# Altium project PAY_IFB.PrjPcb (part 6 of 7)

## Sheet CAN_PHY.SchDoc
size A3; SheetNumber: 19; SheetTotal: 23
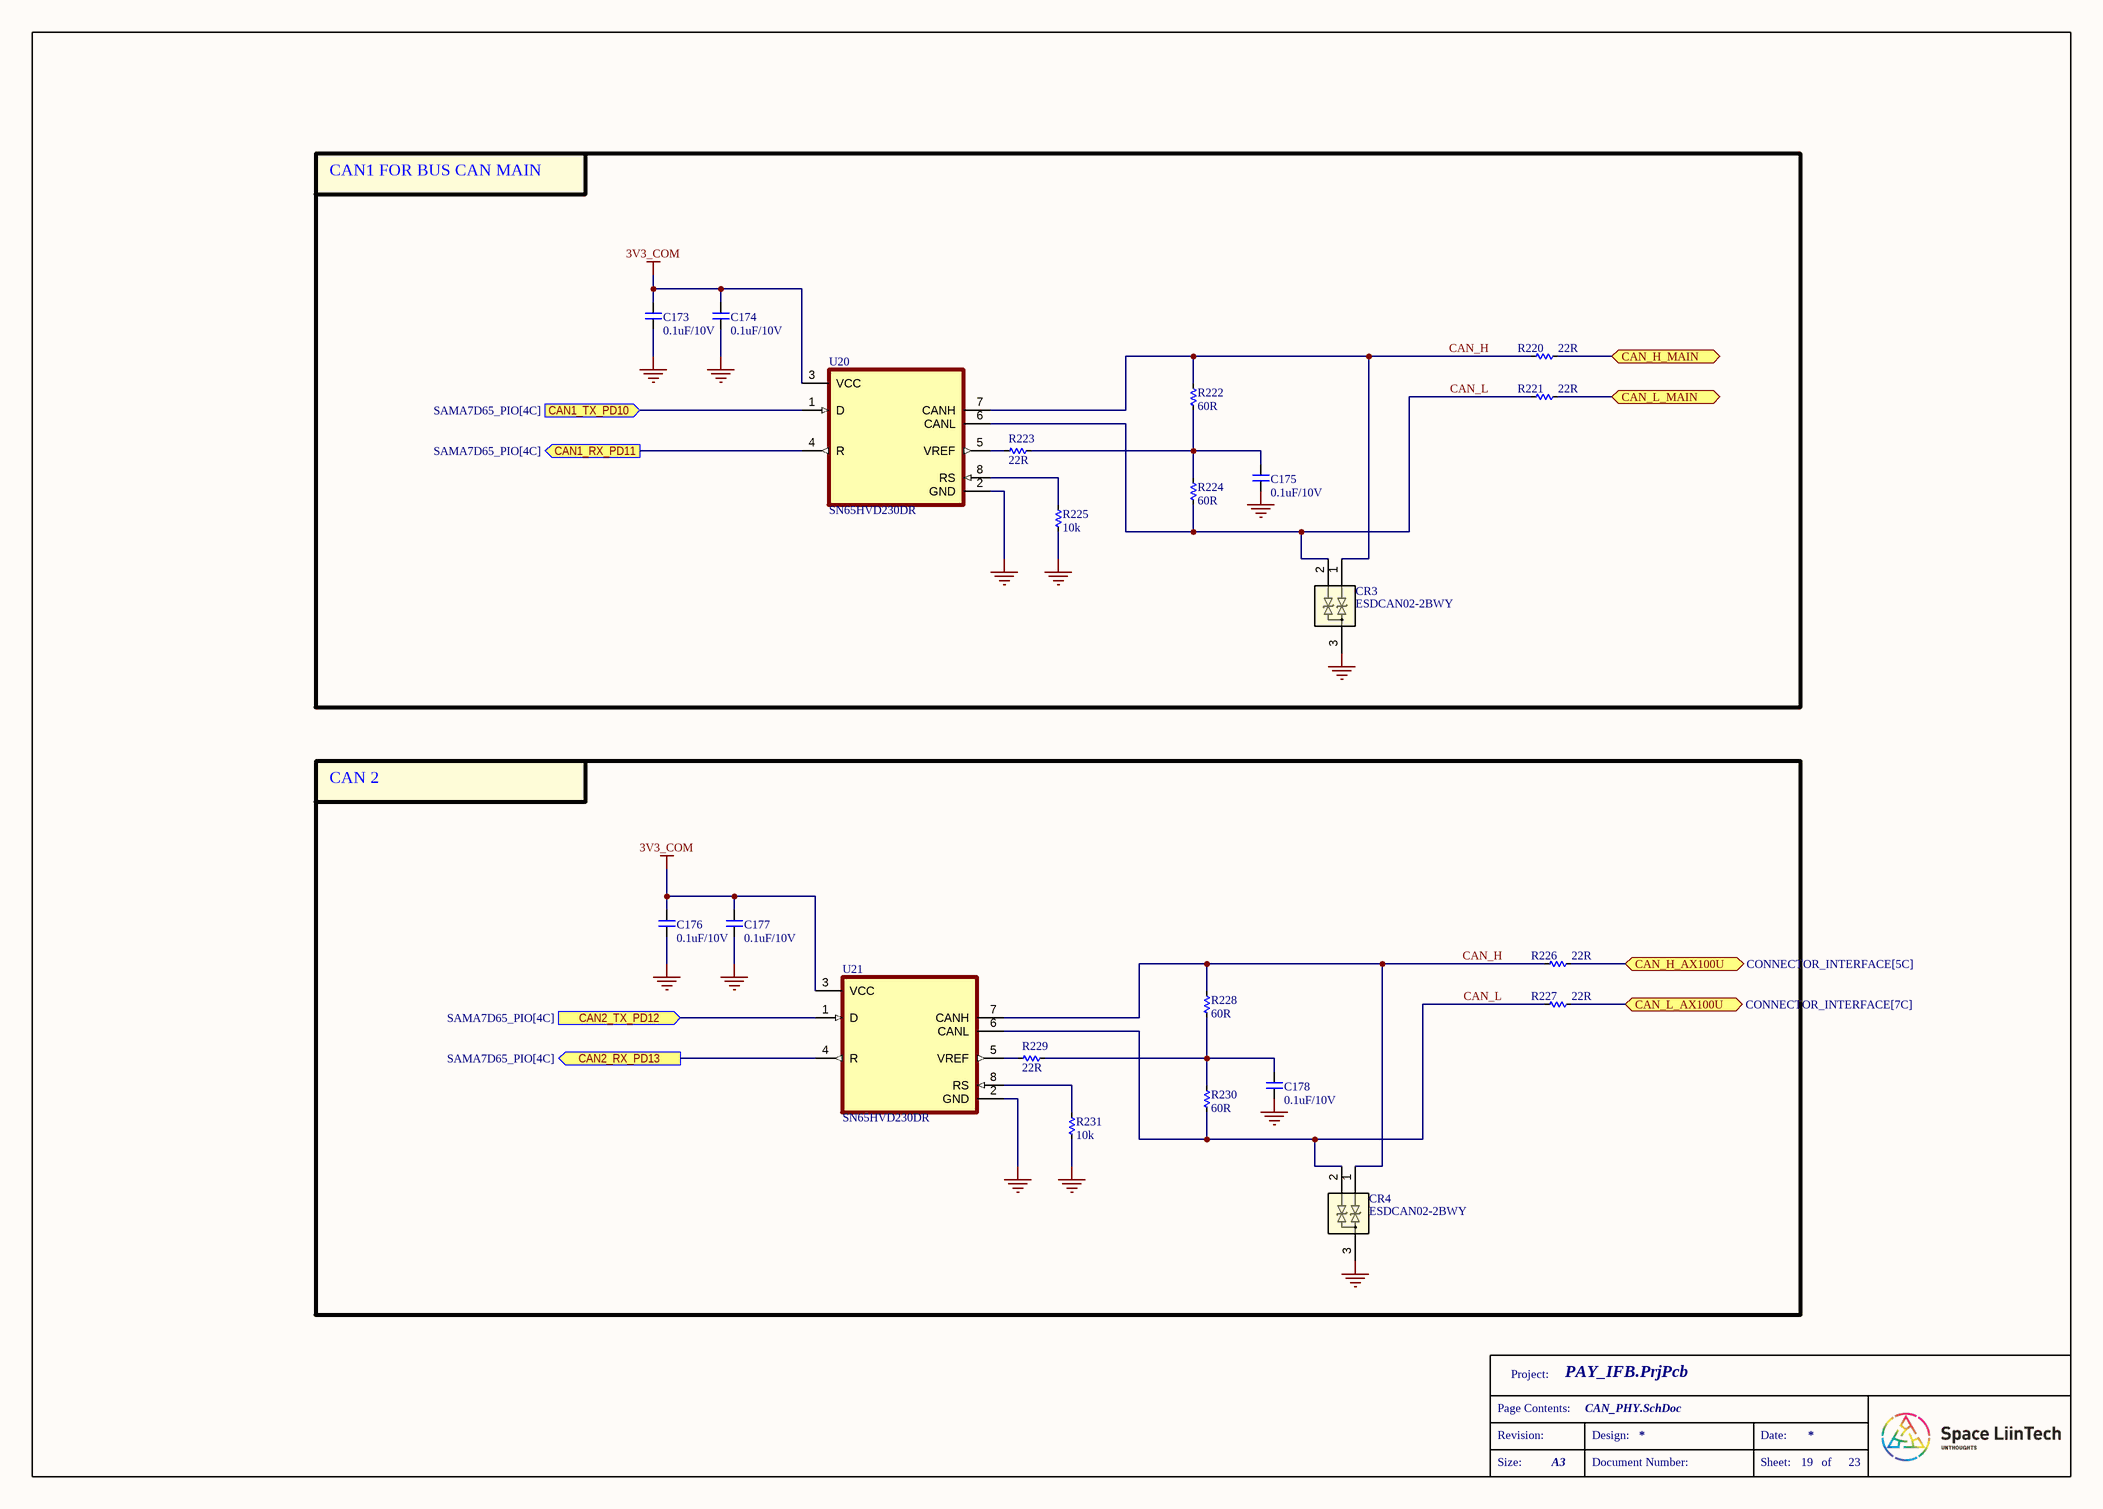
[diagram p23: CAN_PHY.SchDoc]

### Parts
(Parts that share a designator on the sheet are numbered #1, #2 ... from top to bottom, then left to right.)
C173  0.1uF/10V  [CAP_C_1005X50_L]
C174  0.1uF/10V  [CAP_C_1005X50_L]
C175  0.1uF/10V  [CAP_C_1005X50_L]
C176  0.1uF/10V  [CAP_C_1005X50_L]
C177  0.1uF/10V  [CAP_C_1005X50_L]
C178  0.1uF/10V  [CAP_C_1005X50_L]
CR3  ESDCAN02-2BWY  [SOT323-3L_STM]
CR4  ESDCAN02-2BWY  [SOT323-3L_STM]
R220  22R  [RES_C_1005x30_L]
R221  22R  [RES_C_1005x30_L]
R222  60R  [RES_C_1005x30_L]
R223  22R  [RES_C_1005x30_L]
R224  60R  [RES_C_1005x30_L]
R225  10k  [RES_C_1005x30_L]
R226#1  22R  [RES_C_1005x30_L]
R227#1  22R  [RES_C_1005x30_L]
R228#1  60R  [RES_C_1005x30_L]
R229  22R  [RES_C_1005x30_L]
R230  60R  [RES_C_1005x30_L]
R231  10k  [RES_C_1005x30_L]
U20  SN65HVD230DR  [SOIC127P599X175-8N]
U21  SN65HVD230DR  [SOIC127P599X175-8N]

### Blocks framed on the sheet
CAN1 FOR BUS CAN MAIN: C173-C175 CR3 R220-R225 U20
CAN 2: C176-C178 CR4 R226#1 R227#1 R228#1 R229-R231 U21

### Ports
CAN1_RX_PD11 (out, see SAMA7D65_PIO[4C]), CAN1_TX_PD10 (in, see SAMA7D65_PIO[4C]), CAN2_RX_PD13 (out, see SAMA7D65_PIO[4C]), CAN2_TX_PD12 (in, see SAMA7D65_PIO[4C]), CAN_H_AX100U (bidir, see CONNECTOR_INTERFACE[5C]), CAN_H_MAIN (bidir, see CONNECTOR_EXP[4B], CONNECTOR_INTERFACE[4A], CONNECTOR_INTERFACE[5C]), CAN_L_AX100U (bidir, see CONNECTOR_INTERFACE[7C]), CAN_L_MAIN (bidir, see CONNECTOR_EXP[4B], CONNECTOR_INTERFACE[4A], CONNECTOR_INTERFACE[7C])

### Nets
3V3_COM: C173.2 C174.2 C176.2 C177.2 U20.3(VCC) U21.3(VCC)
GND: C173.1 C174.1 C175.1 C176.1 C177.1 C178.1 CR3.3 CR4.3 R225.2 R231.2 U20.2(GND) U21.2(GND)
CAN_H: CR3.1 CR4.1 R220.1 R222.1 R226#1.1 R228#1.1 U20.7(CANH) U21.7(CANH)
CAN_H_main: R220.2 ; port CAN_H_MAIN
CAN_L: CR3.2 CR4.2 R221.1 R224.2 R227#1.1 R230.2 U20.6(CANL) U21.6(CANL)
CAN_L_main: R221.2 ; port CAN_L_MAIN
NetC175_2: C175.2 R222.2 R223.1 R224.1
NetC178_2: C178.2 R228#1.2 R229.1 R230.1
NetJ9_07: R226#1.2 ; port CAN_H_AX100U
NetJ9_08: R227#1.2 ; port CAN_L_AX100U
NetR131_2: U20.1(D) ; port CAN1_TX_PD10
NetR133_2: U20.4(R) ; port CAN1_RX_PD11
NetR135_2: U21.1(D) ; port CAN2_TX_PD12
NetR137_2: U21.4(R) ; port CAN2_RX_PD13
NetR223_2: R223.2 U20.5(VREF)
NetR225_1: R225.1 U20.8(RS)
NetR229_2: R229.2 U21.5(VREF)
NetR231_1: R231.1 U21.8(RS)

### Notes on the sheet
- Project:
- Page Contents:
- Revision:
- Design:
- Date:
- Size:
- A3
- Document Number:
- Sheet:
- of

### Library data of the parts
C173-C178 = _CAP_C_2: CAP CHIP
CR3 CR4 = ESDCAN02-2BWY: TVS DIODE 26.5VWM 44VC SOT3233; Manufacturer_Name: STMicroelectronics; Copyright: Copyright (C) 2025 Ultra Librarian. All rights reserved.; Manufacturer_Part_Number: ESDCAN02-2BWY; RefDes: RefDes; Type: Type
R220-R225 R226#1 R227#1 R228#1 R229-R231 = _RES_B_2: RES
U20 U21 = SN65HVD230DR: 3.3 V CAN Transceiver with Standby Mode; MF: Texas Instruments; SnapEDA_Link: https://www.snapeda.com/parts/SN65HVD230DR/Texas+Instruments/view-part/?ref=snap; Package: SOIC-8 Texas Instruments; Value: *; MP: SN65HVD230DR; Check_prices: https://www.snapeda.com/parts/SN65HVD230DR/Texas+Instruments/view-part/?ref=eda

## Sheet RS485.SchDoc
size 420 x 297 mm; SheetNumber: 20; SheetTotal: 23
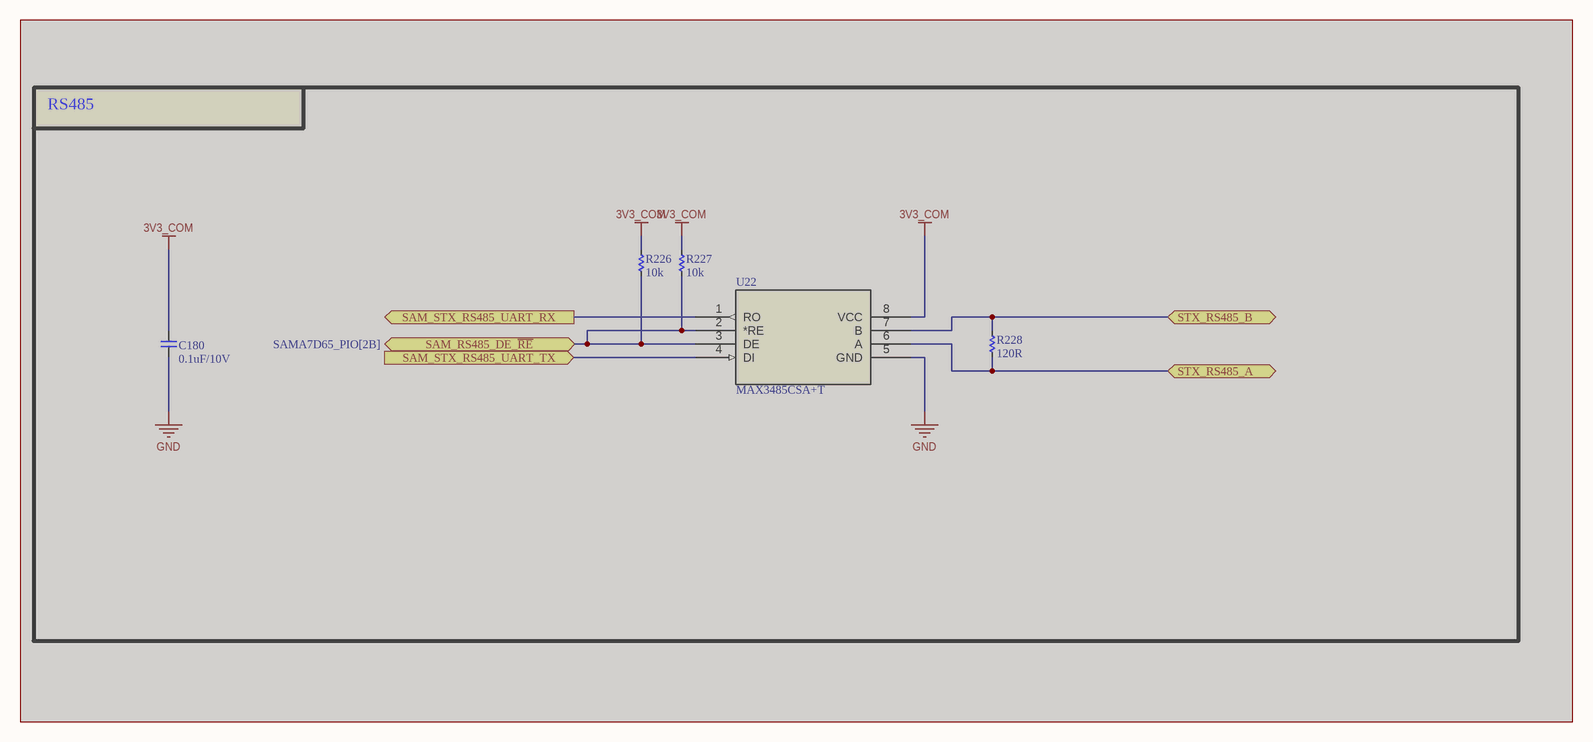
[diagram p24: RS485.SchDoc]

### Parts
(Parts that share a designator on the sheet are numbered #1, #2 ... from top to bottom, then left to right.)
C180#1  0.1uF/10V  [CAP_C_1005X50_L]  (masked out: inside a compile mask, not in the netlist)
R226#2  10k  [RES_C_1005x30_L]  (masked out: inside a compile mask, not in the netlist)
R227#2  10k  [RES_C_1005x30_L]  (masked out: inside a compile mask, not in the netlist)
R228#2  120R  [RES_C_1005x30_L]  (masked out: inside a compile mask, not in the netlist)
U22#1  MAX3485CSA+T  [21-0041-3-M_90-0096-8L_MXM]  (masked out: inside a compile mask, not in the netlist)

### Blocks framed on the sheet
RS485: C180#1 R226#2 R227#2 R228#2 U22#1

### Ports
SAM_RS485_DE_~{RE} (bidir, see SAMA7D65_PIO[2B]), SAM_STX_RS485_UART_RX (out), SAM_STX_RS485_UART_TX (in), STX_RS485_A (bidir), STX_RS485_B (bidir)

### Notes on the sheet
- Project:
- BEE-1012
- Sub-system:
- SATELLITE_EXP_CONTROLLER
- Design by:
- SANG HUYNH
- BAO BUI
- Sheet title:
- Sheet
- A3
- of
- Checked by:
- Approved by:
- VU PHAM
- Revision:
- Document No:
- Size:
- Date:

### Library data of the parts
C180#1 = _CAP_C_2: CAP CHIP
R226#2 R227#2 R228#2 = _RES_B_2: RES
U22#1 = MAX3485CSA+T: Low-Power, Slew-Rate-Limited RS-485/RS-422 Transceivers, IC TRANSCEIVER HALF 1/1 8SOIC; Manufacturer_Name: Analog Devices Inc; Manufacturer_Part_Number: MAX485CSA+T; Copyright: Copyright (C) 2025 Ultra Librarian. All rights reserved.; RefDes: RefDes; Type: Type

## Sheet RS422.SchDoc
size A3; SheetNumber: 21; SheetTotal: 23
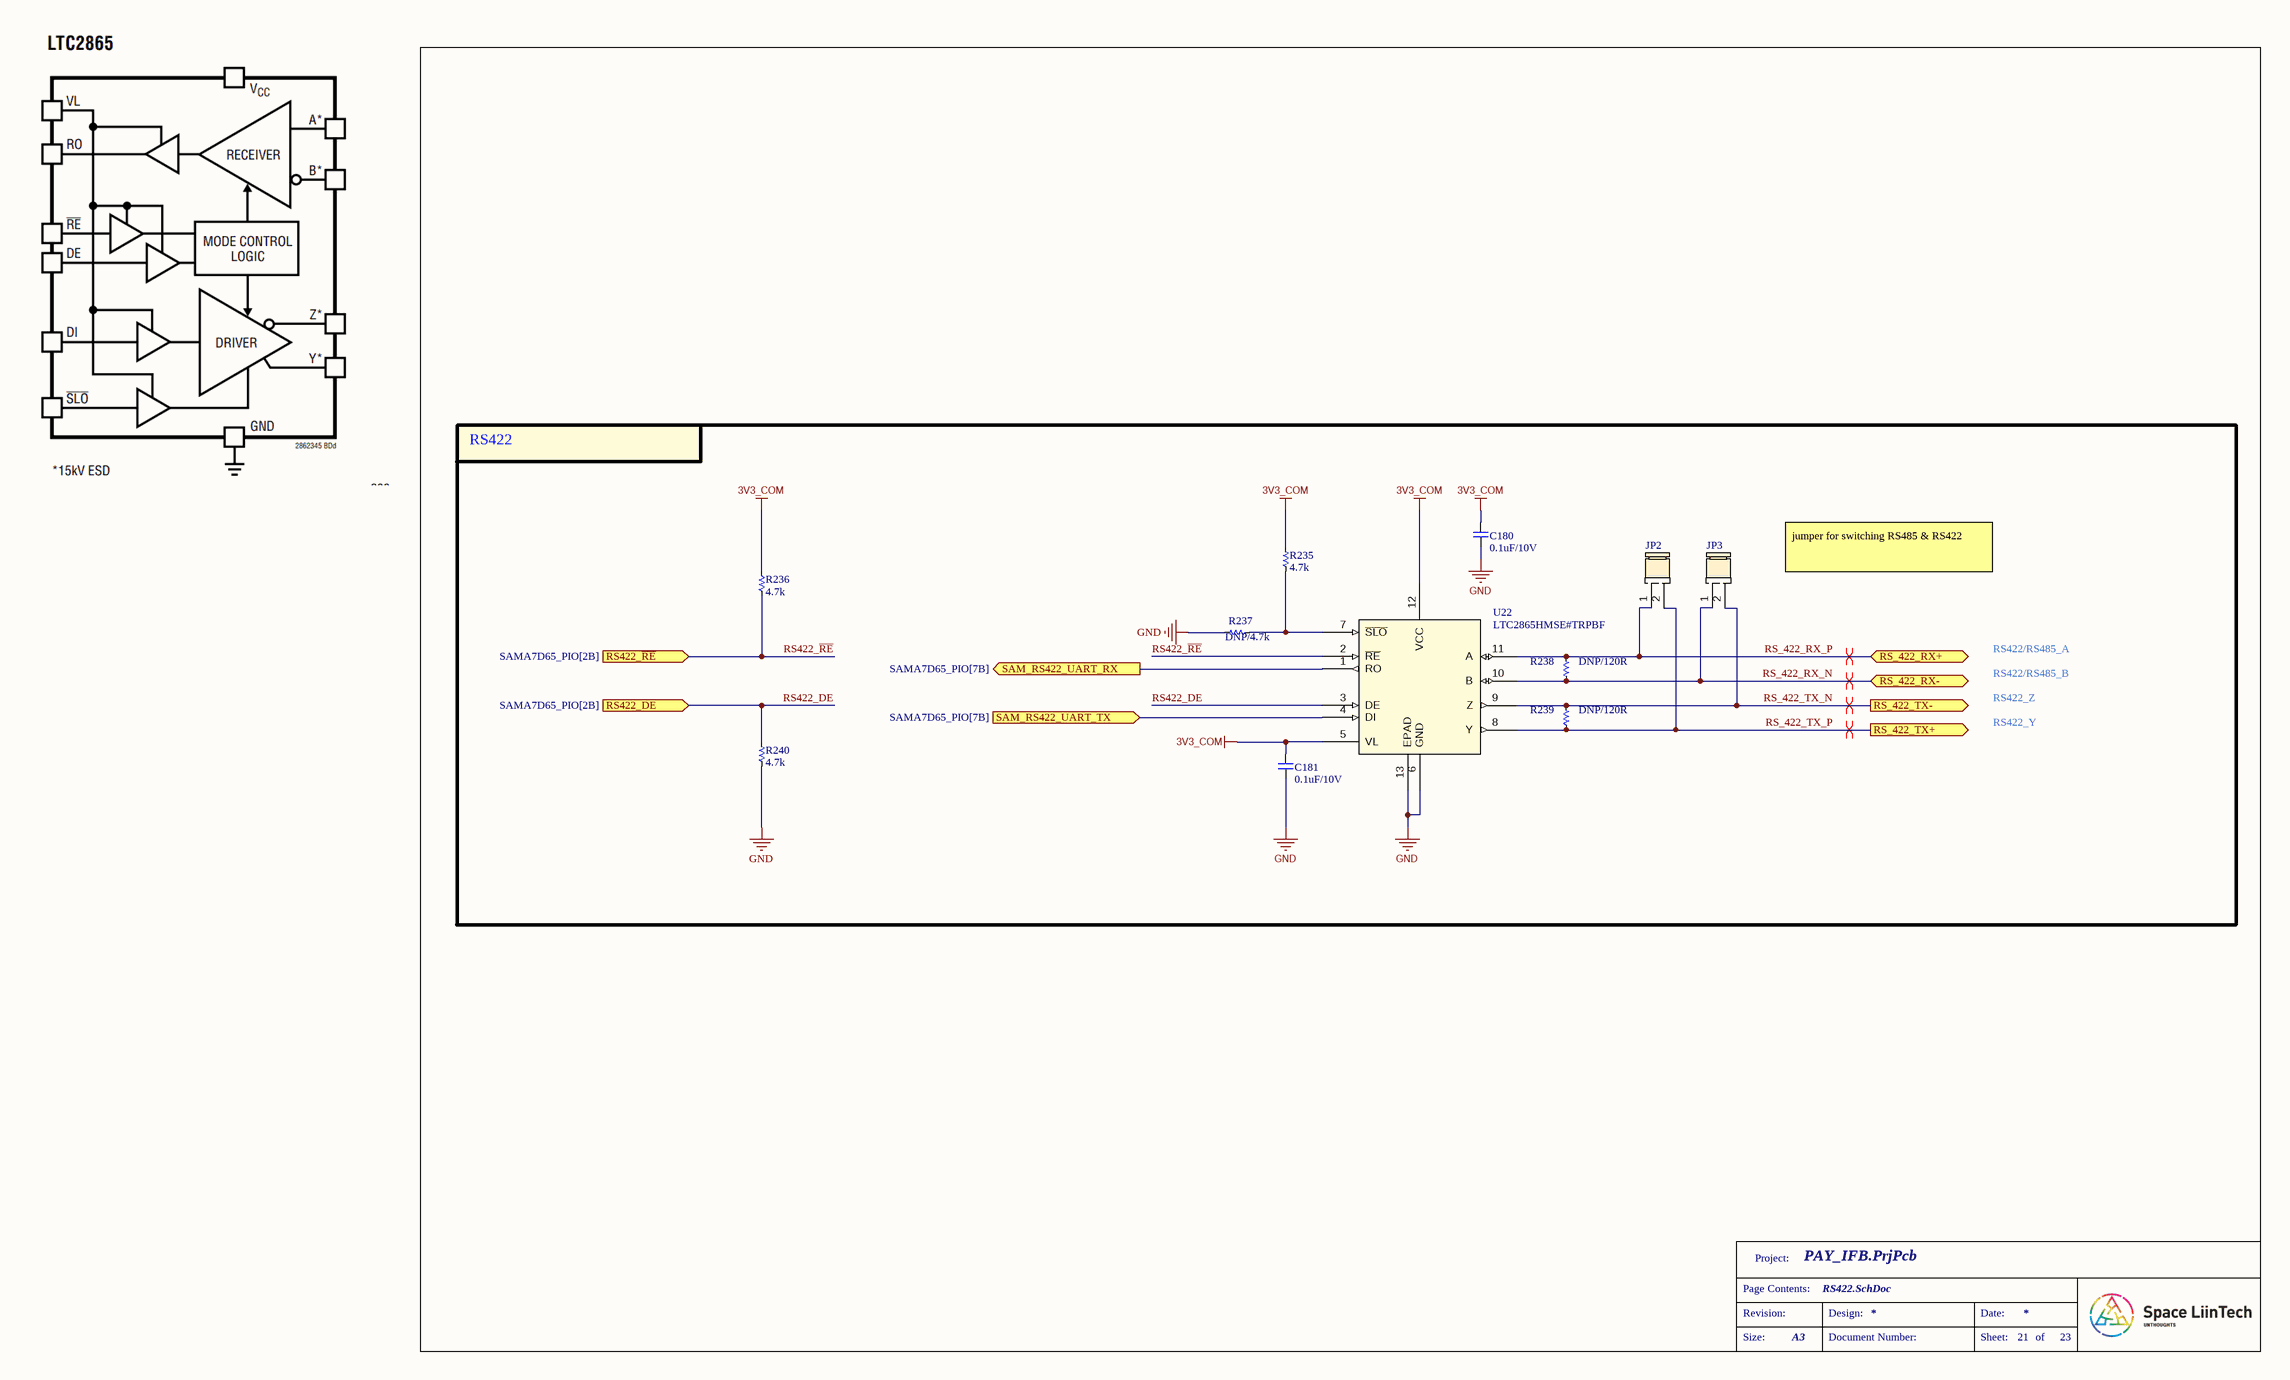
[diagram p25: RS422.SchDoc]

### Parts
(Parts that share a designator on the sheet are numbered #1, #2 ... from top to bottom, then left to right.)
C180#2  0.1uF/10V  [CAP_C_1005X50_L]
C181  0.1uF/10V  [CAP_C_1005X50_L]
JP2  JUMPER_254P_NOPLACE  [JUMPER_254P_2X1_NOPLACE]  (value not drawn)
JP3  JUMPER_254P_NOPLACE  [JUMPER_254P_2X1_NOPLACE]  (value not drawn)
R235  4.7k  [RES_C_1005x30_L]
R236  4.7k  [RES_C_1005x30_L]
R237  DNP/4.7k  [RES_C_1005X40]
R238  DNP/120R  [RES_C_1005x30_L]
R239  DNP/120R  [RES_C_1005x30_L]
R240  4.7k  [RES_C_1005x30_L]
U22#2  LTC2865HMSE#TRPBF  [MSOP-12_MSE_LIT]

### Ports
RS422_DE (in, see SAMA7D65_PIO[2B]), RS422_~{RE} (in, see SAMA7D65_PIO[2B]), RS_422_RX+ (bidir, see CONNECTOR_INTERFACE[2A]), RS_422_RX- (bidir, see CONNECTOR_INTERFACE[2A]), RS_422_TX+ (out, see CONNECTOR_INTERFACE[2A]), RS_422_TX- (out, see CONNECTOR_INTERFACE[2A]), SAM_RS422_UART_RX (out, see SAMA7D65_PIO[7B]), SAM_RS422_UART_TX (in, see SAMA7D65_PIO[7B])

### Nets
3V3_COM: C180#2.2 C181.2 R235.2 R236.2 U22#2.5(VL) U22#2.12(VCC)
GND: C180#2.1 C181.1 R237.2 R240.1 U22#2.6(GND) U22#2.13(EPAD)
FLEXCOM3_UART_RX: U22#2.1(RO) ; port SAM_RS422_UART_RX
FLEXCOM3_UART_TX: U22#2.4(DI) ; port SAM_RS422_UART_TX
RS422_DE: R240.2 U22#2.3(DE) ; port RS422_DE
RS422_~{RE}: R236.1 U22#2.2(~{RE}) ; port RS422_~{RE}
RS_422_RX_N: JP3.1 R238.2 U22#2.10(B) ; port RS_422_RX-
RS_422_RX_P: JP2.1 R238.1 U22#2.11(A) ; port RS_422_RX+
RS_422_TX_N: JP3.2 R239.1 U22#2.9(Z) ; port RS_422_TX-
RS_422_TX_P: JP2.2 R239.2 U22#2.8(Y) ; port RS_422_TX+
NetR235_1: R235.1 R237.1 U22#2.7(~{SLO})

### Layout directives
differential pair: RS_422_RX_N, RS_422_RX_P, RS_422_TX_N, RS_422_TX_P

### Notes on the sheet
- RS422
- jumper for switching RS485 & RS422
- RS422/RS485_A
- RS422/RS485_B
- RS422_Z
- RS422_Y
- Project:
- Page Contents:
- Revision:
- Design:
- Date:
- Size:
- A3
- Document Number:
- Sheet:
- of

### Library data of the parts
C180#2 C181 = _CAP_C_2: CAP CHIP
R235-R240 = _RES_B_2: RES
U22#2 = LTC2865HMSETRPBF: Â±60V Fault Protected 3V to 5.5V RS485/RS422 Transceivers; Manufacturer_Name: Analog Devices Inc; Copyright: Copyright (C) 2025 Ultra Librarian. All rights reserved.; Manufacturer_Part_Number: LTC2865HMSE#TRPBF; RefDes: RefDes; Type: Type

## Sheet BUTTON_LED.SchDoc
size A3; SheetNumber: 22; SheetTotal: 23
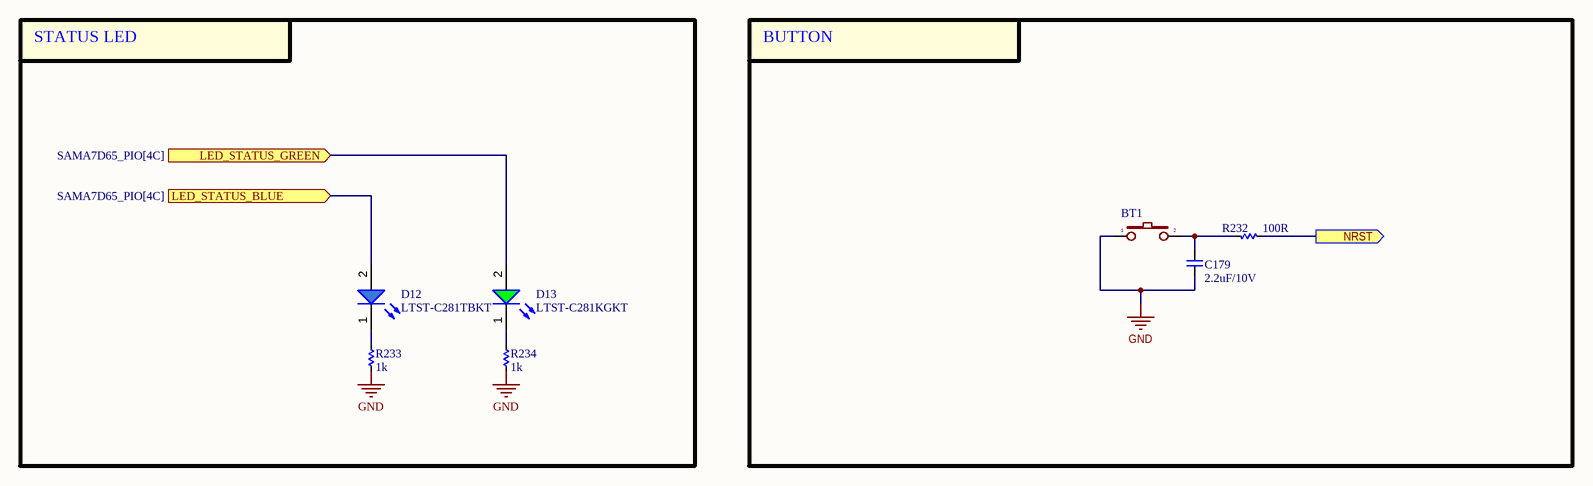
[diagram p26: BUTTON_LED.SchDoc]

### Parts
BT1  BT_  [SW2-SMD]  (value not drawn)
C179  2.2uF/10V  [CAP_C_1005X50_L]
D12  LTST-C281TBKT  [LED_0402]
D13  LTST-C281KGKT  [LED_0402]
R232  100R  [RES_C_1005x30_L]
R233  1k  [RES_C_1005x30_L]
R234  1k  [RES_C_1005x30_L]

### Blocks framed on the sheet
STATUS LED: D12 D13 R233 R234
BUTTON: BT1 C179 R232

### Ports
LED_STATUS_BLUE (in, see SAMA7D65_PIO[4C]), LED_STATUS_GREEN (in, see SAMA7D65_PIO[4C]), NRST (out, see SAMA7D65_MPU[1B], SAMA7D65_PMIC[1B], WATCHDOG[5B])

### Nets
GND: BT1.1 C179.1 R233.1 R234.1
NRST: R232.2 ; port NRST
NetBT1_2: BT1.2 C179.2 R232.1
NetD12_1: D12.1(K) R233.2
NetD12_2: D12.2(A) ; port LED_STATUS_BLUE
NetD13_1: D13.1(K) R234.2
NetD13_2: D13.2(A) ; port LED_STATUS_GREEN

### Notes on the sheet
- Project:
- Page Contents:
- Revision:
- Design:
- Date:
- Size:
- A3
- Document Number:
- Sheet:
- of

### Library data of the parts
BT1 = BT2: Switch button 2 pin; Value: SW chip 2 pin
C179 = _CAP_C_2: CAP CHIP
D12 = LED_BLUE
D13 = LED_GREEN: LED GREEN CLEAR 0402 SMD
R232-R234 = _RES_B_2: RES

## Sheet MOUNTING_HOLE.SchDoc
size A3; SheetNumber: 24; SheetTotal: 24
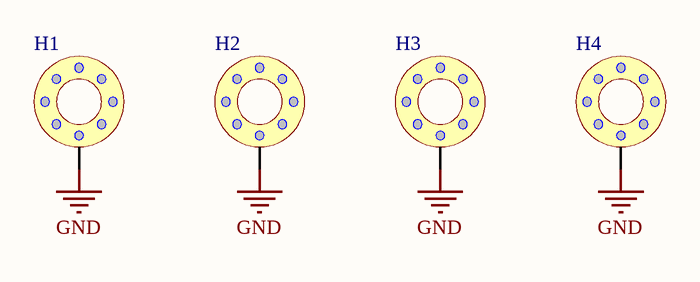
[diagram p27: MOUNTING_HOLE.SchDoc]

### Parts
(Parts that share a designator on the sheet are numbered #1, #2 ... from top to bottom, then left to right.)
H1#2  hole_space  [HOLE_SPACE]  (value not drawn)
H2#2  hole_space  [HOLE_SPACE]  (value not drawn)
H3  hole_space  [HOLE_SPACE]  (value not drawn)
H4  hole_space  [HOLE_SPACE]  (value not drawn)

### Nets
GND: H1#2.1 H2#2.1 H3.1 H4.1

### Notes on the sheet
- Project:
- Page Contents:
- Revision:
- Design:
- Date:
- Size:
- A3
- Document Number:
- Sheet:
- of